# Altium schematic sheet 室内空气监测STM32.SchDoc
size A2
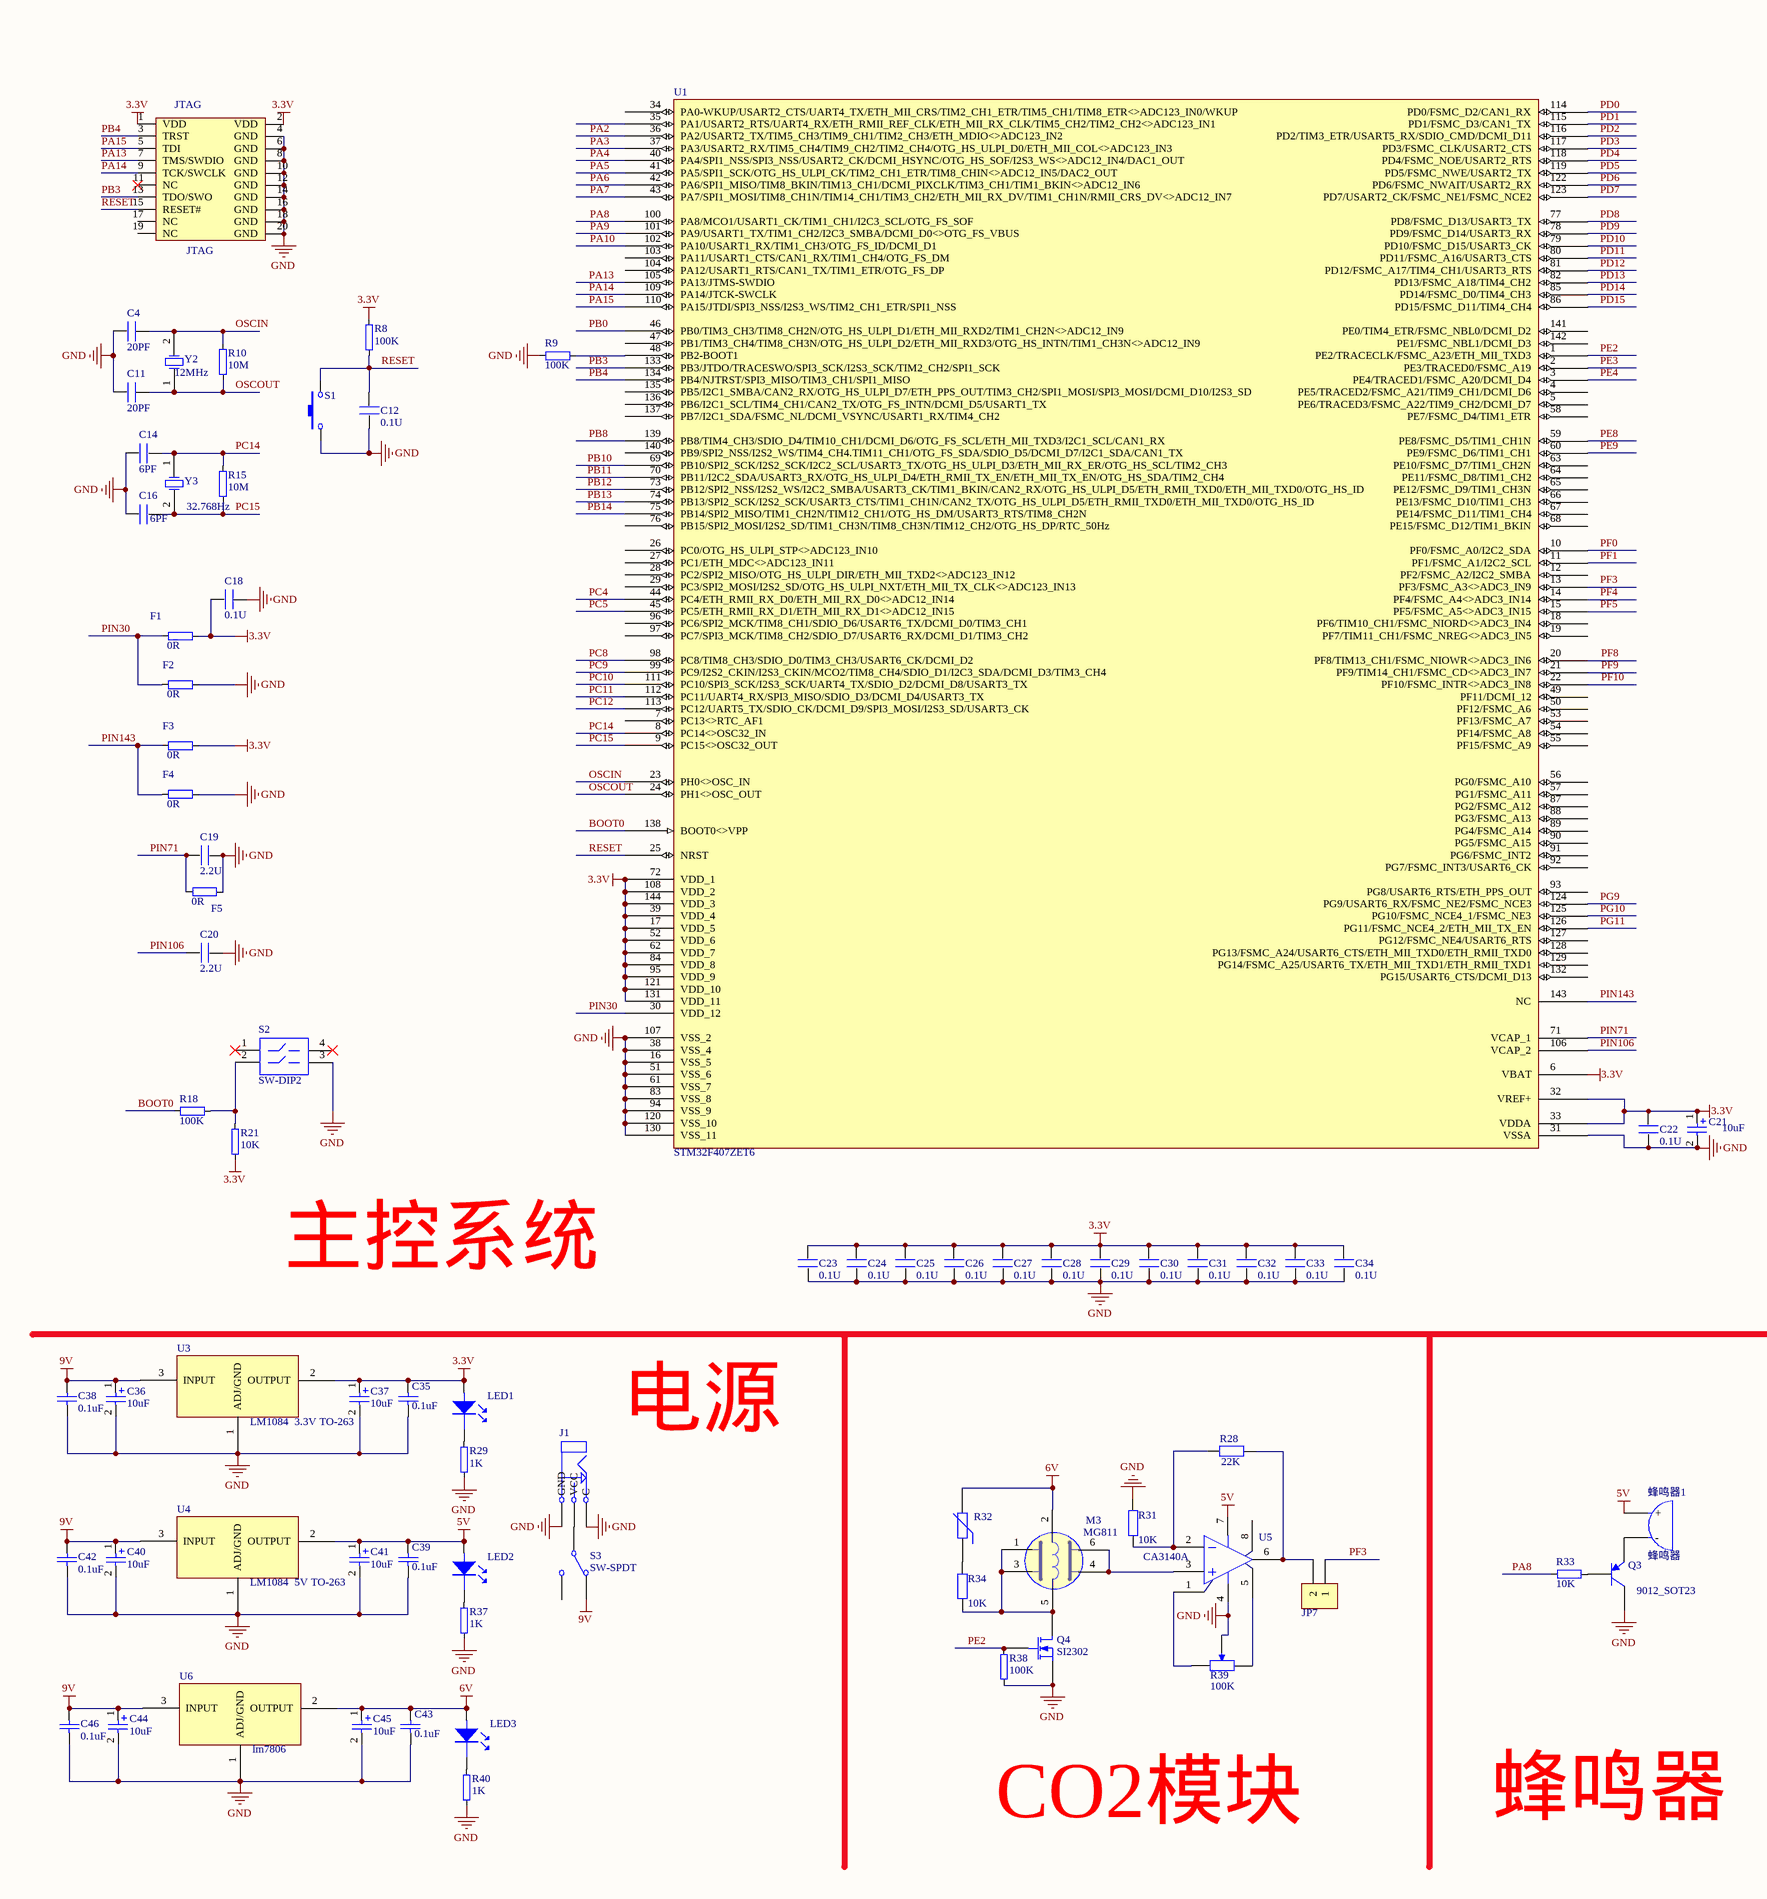
[diagram p0: 室内空气监测STM32.SchDoc, left]
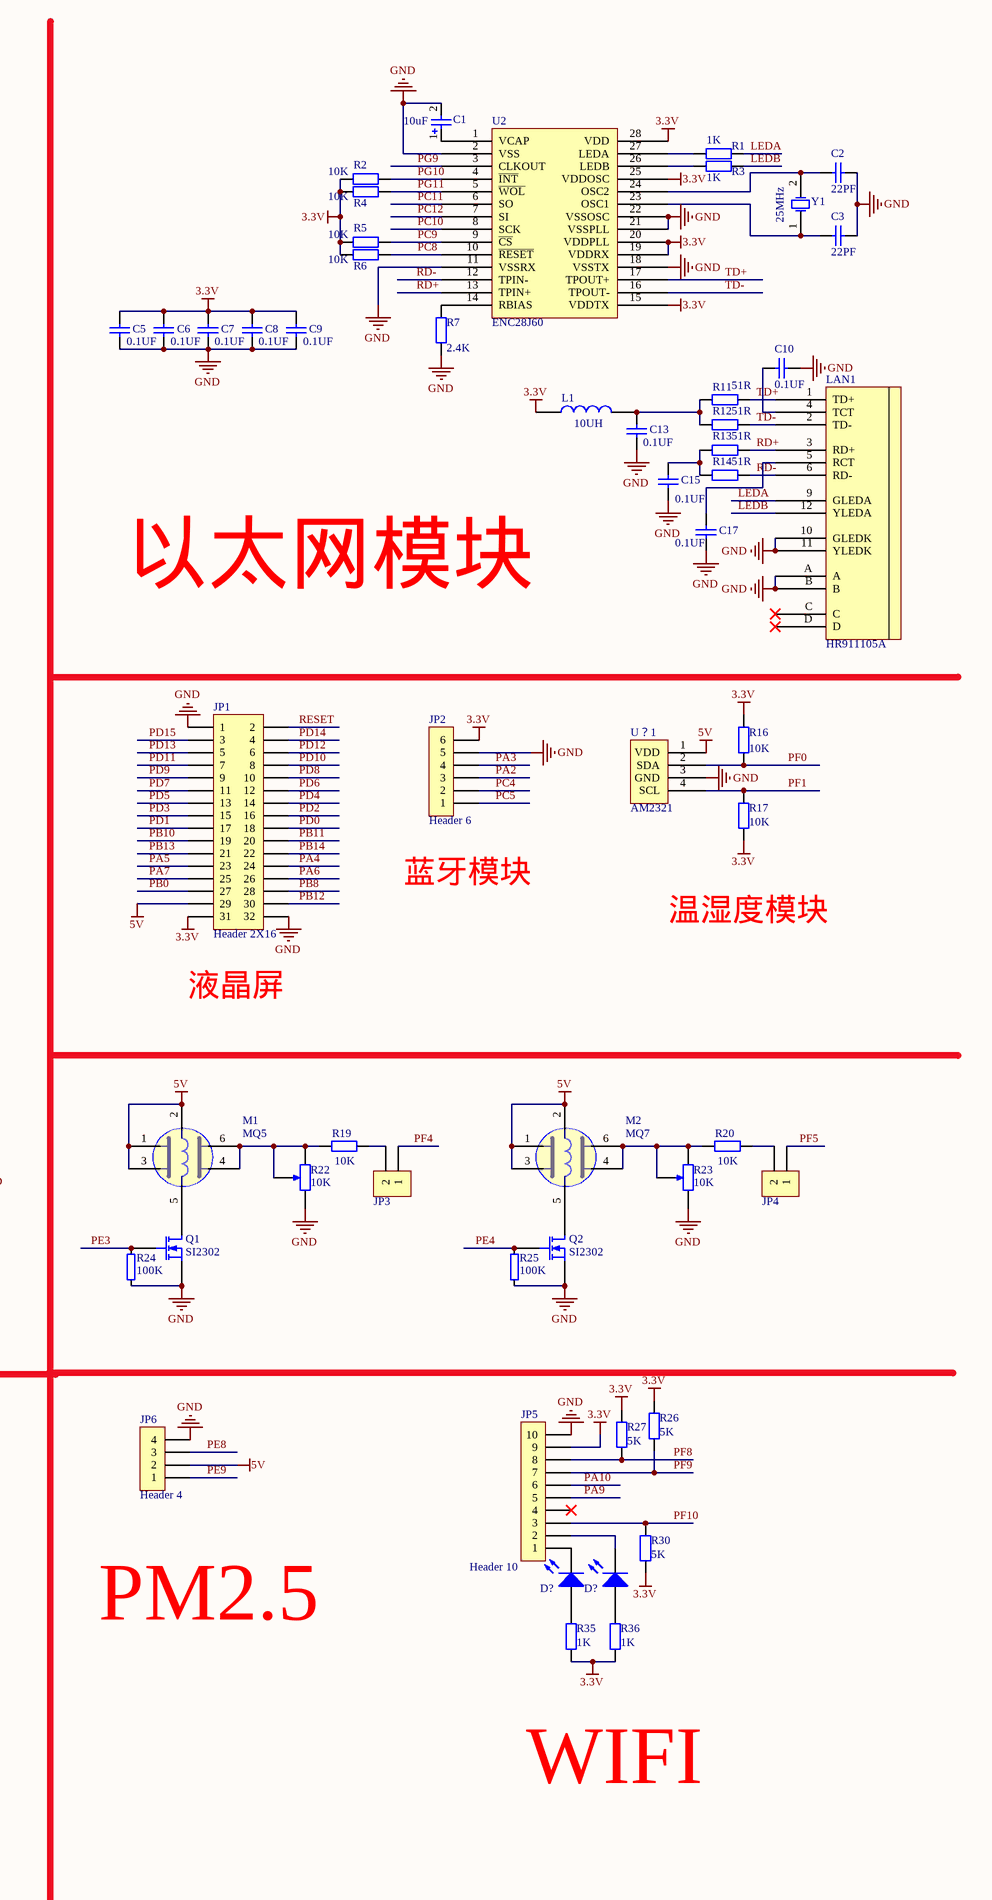
[diagram p1: 室内空气监测STM32.SchDoc, right]

## Parts
(Parts that share a designator on the sheet are numbered #1, #2 ... from top to bottom, then left to right.)
C1  value 10uF  [0805C 10uf]  (hidden comment: Cap Pol2)
C2  22PF  [0603C]
C3  22PF  [0603C]
C4  20PF  [0603P]
C5  0.1UF  [0603C]
C6  0.1UF  [0603C]
C7  0.1UF  [0603C]
C8  0.1UF  [0603C]
C9  0.1UF  [0603C]
C10  0.1UF  [0603C]
C11  20PF  [0603P]
C12  0.1U  [0603P]
C13  0.1UF  [0603C]
C14  6PF  [0603P]
C15  0.1UF  [0603C]
C16  6PF  [0603P]
C17  0.1UF  [0603C]
C18  0.1U  [0603P]
C19  2.2U  [0603P]
C20  2.2U  [0603P]
C21  value 10uF  [0805]
C22  0.1U  [0603P]
C23  0.1U  [0603P]
C24  0.1U  [0603P]
C25  0.1U  [0603P]
C26  0.1U  [0603P]
C27  0.1U  [0603P]
C28  0.1U  [0603P]
C29  0.1U  [0603P]
C30  0.1U  [0603P]
C31  0.1U  [0603P]
C32  0.1U  [0603P]
C33  0.1U  [0603P]
C34  0.1U  [0603P]
C35  0.1uF  [0603C]
C36  value 10uF  [0805C 10uf]  (hidden comment: Cap Pol2)
C37  value 10uF  [0805C 10uf]  (hidden comment: Cap Pol2)
C38  0.1uF  [0603C]
C39  0.1uF  [0603C]
C40  value 10uF  [0805C 10uf]  (hidden comment: Cap Pol2)
C41  value 10uF  [0805C 10uf]  (hidden comment: Cap Pol2)
C42  0.1uF  [0603C]
C43  0.1uF  [0603C]
C44  value 10uF  [0805C 10uf]  (hidden comment: Cap Pol2)
C45  value 10uF  [0805C 10uf]  (hidden comment: Cap Pol2)
C46  0.1uF  [0603C]
D?#1  (no value)  [SMDLED]
D?#2  (no value)  [SMDLED]
F1  0R  [0603R]
F2  0R  [0603R]
F3  0R  [0603R]
F4  0R  [0603R]
F5  0R  [0603R]
J1  (no value)  [PWJ-2/3]
JP1  Header 2X16  [HDR2-16]
JP2  Header 6  [HDR1-6]
JP3  (no value)  [HDR1-2]
JP4  (no value)  [HDR1-2]
JP5  Header 10  [HDR1-10]
JP6  Header 4  [HDR1-4]
JP7  (no value)  [HDR1-2]
JTAG  JTAG  [JTAG_20]
L1  10UH  [0603L]
LAN1  HR911105A  [HR911105A]
LED1  (no value)  [0805D]
LED2  (no value)  [0805D]
LED3  (no value)  [0805D]
M1  MQ5  [MG811]
M2  MQ7  [MG811]
M3  MG811  [MG811]
Q1  SI2302  [SOT23]
Q2  SI2302  [SOT23]
Q3  9012_SOT23  [SOT-23-3L]
Q4  SI2302  [SOT23]
R1  value 1K  [0603R]
R2  value 10K  [0603R]
R3  value 1K  [0603R]
R4  value 10K  [0603R]
R5  value 10K  [0603R]
R6  value 10K  [0603R]
R7  value 2.4K  [0603R]
R8  100K  [0603R]
R9  100K  [0603R]
R10  10M  [0603R]
R11  value 51R  [0603R]
R12  value 51R  [0603R]
R13  value 51R  [0603R]
R14  value 51R  [0603R]
R15  10M  [0603R]
R16  value 10K  [0603R]
R17  value 10K  [0603R]
R18  100K  [0603R]
R19  value 10K  [0603R]
R20  value 10K  [0603R]
R21  10K  [0603R]
R22  value 10K  [电位器 贴片]  (hidden comment: RES-Pot2)
R23  value 10K  [电位器 贴片]  (hidden comment: RES-Pot2)
R24  100K  [0603R]
R25  100K  [0603R]
R26  value 5K  [0603R]
R27  value 5K  [0603R]
R28  value 22K  [0603R]
R29  1K  [0603R]
R30  value 5K  [0603R]
R31  value 10K  [0603R]
R32  (no value)  [0603R]
R33  10K  [0603R]
R34  value 10K  [0603R]
R35  value 1K  [0603R]
R36  value 1K  [0603R]
R37  1K  [0603R]
R38  100K  [0603R]
R39  value 100K  [电位器 贴片]  (hidden comment: RES-Pot2)
R40  1K  [0603R]
S1  (no value)  [两脚贴片按键]
S2  SW-DIP2  [SW-DIP-2]
S3  SW-SPDT  [大电流拨动开关 两档三脚]
U1  STM32F407ZET6  [LQFP144]
U2  ENC28J60  [SSOP28]
U3  LM1084  3.3V TO-263  [LM1084 TO-263]
U4  LM1084  5V TO-263  [LM1084 TO-263]
U5  CA3140A  [SOP8]
U6  lm7806  [LM1084 TO-263]
U？1  AM2321  [AM2321]
Y1  25MHz  [XTAL_US]
Y2  12MHz  [XTAL_US]
Y3  value 32.768Hz  [BCY-W2/32.768KHz]
蜂鸣器1  蜂鸣器  [BELL0.3-0.46]

## Nets
3.3V: C5.1 C6.1 C7.1 C8.1 C9.1 C18.2 C21.1 C22.2 C23.2 C24.2 C25.2 C26.2 C27.2 C28.2 C29.2 C30.2 C31.2 C32.2 C33.2 C34.2 C35.2 C37.1 F1.2 F3.2 JP1.31 JP2.6 JP5.9 JTAG.1(VDD) JTAG.2(VDD) L1.1 LED1.A R2.1 R4.1 R5.1 R6.1 R8.2 R16.1 R17.2 R21.1 R26.1 R27.1 R30.2 R35.2 R36.2 U1.6(VBAT) U1.17(VDD_5) U1.32(VREF+) U1.33(VDDA) U1.39(VDD_4) U1.52(VDD_6) U1.62(VDD_7) U1.72(VDD_1) U1.84(VDD_8) U1.95(VDD_9) U1.108(VDD_2) U1.121(VDD_10) U1.131(VDD_11) U1.144(VDD_3) U2.15(VDDTX) U2.19(VDDRX) U2.20(VDDPLL) U2.25(VDDOSC) U2.28(VDD) U3.2(OUTPUT)
5V: C39.2 C41.1 JP1.29 JP6.2 LED2.A M1.1 M1.2 M1.3 M2.1 M2.2 M2.3 U4.2(OUTPUT) U5.7 U？1.1(VDD) 蜂鸣器1.1(+)
6V: C43.2 C45.1 LED3.A M3.2 R32.2 U6.2(OUTPUT)
9V: C36.1 C38.2 C40.1 C42.2 C44.1 C46.2 S3.1(NC) U3.3(INPUT) U4.3(INPUT) U6.3(INPUT)
GND: C1.2 C2.1 C3.1 C4.2 C5.2 C6.2 C7.2 C8.2 C9.2 C10.2 C11.2 C12.1 C13.2 C14.1 C15.1 C16.1 C17.2 C18.1 C19.1 C20.1 C21.2 C22.1 C23.1 C24.1 C25.1 C26.1 C27.1 C28.1 C29.1 C30.1 C31.1 C32.1 C33.1 C34.1 C35.1 C36.2 C37.2 C38.1 C39.1 C40.2 C41.2 C42.1 C43.1 C44.2 C45.2 C46.1 F2.2 F4.2 F5.2 J1.2(GND) J1.3(C) JP1.1 JP1.32 JP2.5 JP5.10 JP6.4 JTAG.4(GND) JTAG.6(GND) JTAG.8(GND) JTAG.10(GND) JTAG.12(GND) JTAG.14(GND) JTAG.16(GND) JTAG.18(GND) JTAG.20(GND) LAN1.10(GLEDK) LAN1.11(YLEDK) LAN1.A LAN1.B Q1.2(S) Q2.2(S) Q3.3(C) Q4.2(S) R7.1 R9.2 R22.1(BOT) R23.1(BOT) R24.2 R25.2 R29.2 R31.2 R37.2 R38.2 R39.2(TAP) R40.2 S1.1 S2.3 U1.16(VSS_5) U1.31(VSSA) U1.38(VSS_4) U1.51(VSS_6) U1.61(VSS_7) U1.83(VSS_8) U1.94(VSS_9) U1.107(VSS_2) U1.120(VSS_10) U1.130(VSS_11) U2.2(VSS) U2.11(VSSRX) U2.18(VSSTX) U2.21(VSSPLL) U2.22(VSSOSC) U3.1(ADJ/GND) U4.1(ADJ/GND) U5.4 U6.1(ADJ/GND) U？1.3(GND)
BOOT0: R18.1 U1.138(BOOT0<>VPP)
LEDA: LAN1.9(GLEDA) R1.2
LEDB: LAN1.12(YLEDA) R3.2
OSCIN: C4.1 R10.2 U1.23(PH0<>OSC_IN) Y2.2(OSC2)
OSCOUT: C11.1 R10.1 U1.24(PH1<>OSC_OUT) Y2.1(OSC1)
PA2: JP2.3 U1.36(PA2/USART2_TX/TIM5_CH3/TIM9_CH1/TIM2_CH3/ETH_MDIO<>ADC123_IN2)
PA3: JP2.4 U1.37(PA3/USART2_RX/TIM5_CH4/TIM9_CH2/TIM2_CH4/OTG_HS_ULPI_D0/ETH_MII_COL<>ADC123_IN3)
PA4: JP1.24 U1.40(PA4/SPI1_NSS/SPI3_NSS/USART2_CK/DCMI_HSYNC/OTG_HS_SOF/I2S3_WS<>ADC12_IN4/DAC1_OUT)
PA5: JP1.23 U1.41(PA5/SPI1_SCK/OTG_HS_ULPI_CK/TIM2_CH1_ETR/TIM8_CHIN<>ADC12_IN5/DAC2_OUT)
PA6: JP1.26 U1.42(PA6/SPI1_MISO/TIM8_BKIN/TIM13_CH1/DCMI_PIXCLK/TIM3_CH1/TIM1_BKIN<>ADC12_IN6)
PA7: JP1.25 U1.43(PA7/SPI1_MOSI/TIM8_CH1N/TIM14_CH1/TIM3_CH2/ETH_MII_RX_DV/TIM1_CH1N/RMII_CRS_DV<>ADC12_IN7)
PA8: R33.2 U1.100(PA8/MCO1/USART1_CK/TIM1_CH1/I2C3_SCL/OTG_FS_SOF)
PA9: JP5.5 U1.101(PA9/USART1_TX/TIM1_CH2/I2C3_SMBA/DCMI_D0<>OTG_FS_VBUS)
PA10: JP5.6 U1.102(PA10/USART1_RX/TIM1_CH3/OTG_FS_ID/DCMI_D1)
PA13: JTAG.7(TMS/SWDIO) U1.105(PA13/JTMS-SWDIO)
PA14: JTAG.9(TCK/SWCLK) U1.109(PA14/JTCK-SWCLK)
PA15: JTAG.5(TDI) U1.110(PA15/JTDI/SPI3_NSS/I2S3_WS/TIM2_CH1_ETR/SPI1_NSS)
PB0: JP1.27 U1.46(PB0/TIM3_CH3/TIM8_CH2N/OTG_HS_ULPI_D1/ETH_MII_RXD2/TIM1_CH2N<>ADC12_IN9)
PB3: JTAG.13(TDO/SWO) U1.133(PB3/JTDO/TRACESWO/SPI3_SCK/I2S3_SCK/TIM2_CH2/SPI1_SCK)
PB4: JTAG.3(TRST) U1.134(PB4/NJTRST/SPI3_MISO/TIM3_CH1/SPI1_MISO)
PB8: JP1.28 U1.139(PB8/TIM4_CH3/SDIO_D4/TIM10_CH1/DCMI_D6/OTG_FS_SCL/ETH_MII_TXD3/I2C1_SCL/CAN1_RX)
PB10: JP1.19 U1.69(PB10/SPI2_SCK/I2S2_SCK/I2C2_SCL/USART3_TX/OTG_HS_ULPI_D3/ETH_MII_RX_ER/OTG_HS_SCL/TIM2_CH3)
PB11: JP1.20 U1.70(PB11/I2C2_SDA/USART3_RX/OTG_HS_ULPI_D4/ETH_RMII_TX_EN/ETH_MII_TX_EN/OTG_HS_SDA/TIM2_CH4)
PB12: JP1.30 U1.73(PB12/SPI2_NSS/I2S2_WS/I2C2_SMBA/USART3_CK/TIM1_BKIN/CAN2_RX/OTG_HS_ULPI_D5/ETH_RMII_TXD0/ETH_MII_TXD0/OTG_HS_ID)
PB13: JP1.21 U1.74(PB13/SPI2_SCK/I2S2_SCK/USART3_CTS/TIM1_CH1N/CAN2_TX/OTG_HS_ULPI_D5/ETH_RMII_TXD0/ETH_MII_TXD0/OTG_HS_ID)
PB14: JP1.22 U1.75(PB14/SPI2_MISO/TIM1_CH2N/TIM12_CH1/OTG_HS_DM/USART3_RTS/TIM8_CH2N)
PC4: JP2.2 U1.44(PC4/ETH_RMII_RX_D0/ETH_MII_RX_D0<>ADC12_IN14)
PC5: JP2.1 U1.45(PC5/ETH_RMII_RX_D1/ETH_MII_RX_D1<>ADC12_IN15)
PC8: R6.2 U1.98(PC8/TIM8_CH3/SDIO_D0/TIM3_CH3/USART6_CK/DCMI_D2) U2.10(~{RESET})
PC9: R5.2 U1.99(PC9/I2S2_CKIN/I2S3_CKIN/MCO2/TIM8_CH4/SDIO_D1/I2C3_SDA/DCMI_D3/TIM3_CH4) U2.9(~{CS})
PC10: U1.111(PC10/SPI3_SCK/I2S3_SCK/UART4_TX/SDIO_D2/DCMI_D8/USART3_TX) U2.8(SCK)
PC11: U1.112(PC11/UART4_RX/SPI3_MISO/SDIO_D3/DCMI_D4/USART3_TX) U2.6(SO)
PC12: U1.113(PC12/UART5_TX/SDIO_CK/DCMI_D9/SPI3_MOSI/I2S3_SD/USART3_CK) U2.7(SI)
PC14: C14.2 R15.2 U1.8(PC14<>OSC32_IN) Y3.1(OSC1)
PC15: C16.2 R15.1 U1.9(PC15<>OSC32_OUT) Y3.2(OSC2)
PD0: JP1.18 U1.114(PD0/FSMC_D2/CAN1_RX)
PD1: JP1.17 U1.115(PD1/FSMC_D3/CAN1_TX)
PD2: JP1.16 U1.116(PD2/TIM3_ETR/USART5_RX/SDIO_CMD/DCMI_D11)
PD3: JP1.15 U1.117(PD3/FSMC_CLK/USART2_CTS)
PD4: JP1.14 U1.118(PD4/FSMC_NOE/USART2_RTS)
PD5: JP1.13 U1.119(PD5/FSMC_NWE/USART2_TX)
PD6: JP1.12 U1.122(PD6/FSMC_NWAIT/USART2_RX)
PD7: JP1.11 U1.123(PD7/USART2_CK/FSMC_NE1/FSMC_NCE2)
PD8: JP1.10 U1.77(PD8/FSMC_D13/USART3_TX)
PD9: JP1.9 U1.78(PD9/FSMC_D14/USART3_RX)
PD10: JP1.8 U1.79(PD10/FSMC_D15/USART3_CK)
PD11: JP1.7 U1.80(PD11/FSMC_A16/USART3_CTS)
PD12: JP1.6 U1.81(PD12/FSMC_A17/TIM4_CH1/USART3_RTS)
PD13: JP1.5 U1.82(PD13/FSMC_A18/TIM4_CH2)
PD14: JP1.4 U1.85(PD14/FSMC_D0/TIM4_CH3)
PD15: JP1.3 U1.86(PD15/FSMC_D11/TIM4_CH4)
PE2: Q4.1(G) R38.1 U1.1(PE2/TRACECLK/FSMC_A23/ETH_MII_TXD3)
PE3: Q1.1(G) R24.1 U1.2(PE3/TRACED0/FSMC_A19)
PE4: Q2.1(G) R25.1 U1.3(PE4/TRACED1/FSMC_A20/DCMI_D4)
PE8: JP6.3 U1.59(PE8/FSMC_D5/TIM1_CH1N)
PE9: JP6.1 U1.60(PE9/FSMC_D6/TIM1_CH1)
PF0: R16.2 U1.10(PF0/FSMC_A0/I2C2_SDA) U？1.2(SDA)
PF1: R17.1 U1.11(PF1/FSMC_A1/I2C2_SCL) U？1.4(SCL)
PF3: JP7.1 U1.13(PF3/FSMC_A3<>ADC3_IN9)
PF4: JP3.1 U1.14(PF4/FSMC_A4<>ADC3_IN14)
PF5: JP4.1 U1.15(PF5/FSMC_A5<>ADC3_IN15)
PF8: JP5.8 R27.2 U1.20(PF8/TIM13_CH1/FSMC_NIOWR<>ADC3_IN6)
PF9: JP5.7 R26.2 U1.21(PF9/TIM14_CH1/FSMC_CD<>ADC3_IN7)
PF10: JP5.3 R30.1 U1.22(PF10/FSMC_INTR<>ADC3_IN8)
PG9: U1.124(PG9/USART6_RX/FSMC_NE2/FSMC_NCE3) U2.3(CLKOUT)
PG10: R2.2 U1.125(PG10/FSMC_NCE4_1/FSMC_NE3) U2.4(~{INT})
PG11: R4.2 U1.126(PG11/FSMC_NCE4_2/ETH_MII_TX_EN) U2.5(~{WOL})
PIN30: F1.1 F2.1 U1.30(VDD_12)
PIN71: C19.2 F5.1 U1.71(VCAP_1)
PIN106: C20.2 U1.106(VCAP_2)
PIN143: F3.1 F4.1 U1.143(NC)
RD+: LAN1.3(RD+) R13.1 U2.13(TPIN+)
RD-: LAN1.6(RD-) R14.1 U2.12(TPIN-)
RESET: C12.2 JP1.2 JTAG.15(RESET#) R8.1 S1.2 U1.25(NRST)
TD+: LAN1.1(TD+) R11.1 U2.17(TPOUT+)
TD-: LAN1.2(TD-) R12.1 U2.16(TPOUT-)
NetC1_1: C1.1 U2.1(VCAP)
NetC2_2: C2.2 U2.24(OSC2) Y1.2(OSC2)
NetC3_2: C3.2 U2.23(OSC1) Y1.1(OSC1)
NetC10_1: C10.1 LAN1.4(TCT)
NetC13_1: C13.1 L1.2 R11.2 R12.2
NetC15_2: C15.2 R13.2 R14.2
NetC17_1: C17.1 LAN1.5(RCT)
NetD?#1_1: D?#1.1(A) R35.1
NetD?#1_2: D?#1.2(K) JP5.1
NetD?#2_1: D?#2.1(A) R36.1
NetD?#2_2: D?#2.2(K) JP5.2
NetJ1_1: J1.1(VCC) S3.2(COMMON)
NetJP3_2: JP3.2 R19.2
NetJP4_2: JP4.2 R20.2
NetJP7_2: JP7.2 R28.1 U5.6
NetLED1_K: LED1.K R29.1
NetLED2_K: LED2.K R37.1
NetLED3_K: LED3.K R40.1
NetM1_4: M1.4 M1.6 R19.1 R22.2(TAP) R22.3(TOP)
NetM1_5: M1.5 Q1.3(D)
NetM2_4: M2.4 M2.6 R20.1 R23.2(TAP) R23.3(TOP)
NetM2_5: M2.5 Q2.3(D)
NetM3_1: M3.1 M3.3 M3.5 Q4.3(D) R34.1
NetM3_4: M3.4 M3.6 U5.3
NetQ3_1: Q3.1(B) R33.1
NetQ3_2: Q3.2(E) 蜂鸣器1.2(-)
NetR1_1: R1.1 U2.27(LEDA)
NetR3_1: R3.1 U2.26(LEDB)
NetR7_2: R7.2 U2.14(RBIAS)
NetR9_1: R9.1 U1.48(PB2-BOOT1)
NetR18_2: R18.2 R21.2 S2.2
NetR28_2: R28.2 R31.1 U5.2
NetR32_1: R32.1 R34.2
NetR39_1: R39.1(BOT) U5.1
NetR39_3: R39.3(TOP) U5.5

Not connected (* = marked no-connect by the designer): JP5 4*; JTAG 11(NC)* 17(NC) 19(NC); LAN1 C* D*; S2 1* 4*; S3 3(NO); U1 4(PE5/TRACED2/FSMC_A21/TIM9_CH1/DCMI_D6) 5(PE6/TRACED3/FSMC_A22/TIM9_CH2/DCMI_D7) 7(PC13<>RTC_AF1) 12(PF2/FSMC_A2/I2C2_SMBA) 18(PF6/TIM10_CH1/FSMC_NIORD<>ADC3_IN4) 19(PF7/TIM11_CH1/FSMC_NREG<>ADC3_IN5) 26(PC0/OTG_HS_ULPI_STP<>ADC123_IN10) 27(PC1/ETH_MDC<>ADC123_IN11) 28(PC2/SPI2_MISO/OTG_HS_ULPI_DIR/ETH_MII_TXD2<>ADC123_IN12) 29(PC3/SPI2_MOSI/I2S2_SD/OTG_HS_ULPI_NXT/ETH_MII_TX_CLK<>ADC123_IN13) 34(PA0-WKUP/USART2_CTS/UART4_TX/ETH_MII_CRS/TIM2_CH1_ETR/TIM5_CH1/TIM8_ETR<>ADC123_IN0/WKUP) 35(PA1/USART2_RTS/UART4_RX/ETH_RMII_REF_CLK/ETH_MII_RX_CLK/TIM5_CH2/TIM2_CH2<>ADC123_IN1) 47(PB1/TIM3_CH4/TIM8_CH3N/OTG_HS_ULPI_D2/ETH_MII_RXD3/OTG_HS_INTN/TIM1_CH3N<>ADC12_IN9) 49(PF11/DCMI_12) 50(PF12/FSMC_A6) 53(PF13/FSMC_A7) 54(PF14/FSMC_A8) 55(PF15/FSMC_A9) 56(PG0/FSMC_A10) 57(PG1/FSMC_A11) 58(PE7/FSMC_D4/TIM1_ETR) 63(PE10/FSMC_D7/TIM1_CH2N) 64(PE11/FSMC_D8/TIM1_CH2) 65(PE12/FSMC_D9/TIM1_CH3N) 66(PE13/FSMC_D10/TIM1_CH3) 67(PE14/FSMC_D11/TIM1_CH4) 68(PE15/FSMC_D12/TIM1_BKIN) 76(PB15/SPI2_MOSI/I2S2_SD/TIM1_CH3N/TIM8_CH3N/TIM12_CH2/OTG_HS_DP/RTC_50Hz) 87(PG2/FSMC_A12) 88(PG3/FSMC_A13) 89(PG4/FSMC_A14) 90(PG5/FSMC_A15) 91(PG6/FSMC_INT2) 92(PG7/FSMC_INT3/USART6_CK) 93(PG8/USART6_RTS/ETH_PPS_OUT) 96(PC6/SPI2_MCK/TIM8_CH1/SDIO_D6/USART6_TX/DCMI_D0/TIM3_CH1) 97(PC7/SPI3_MCK/TIM8_CH2/SDIO_D7/USART6_RX/DCMI_D1/TIM3_CH2) 103(PA11/USART1_CTS/CAN1_RX/TIM1_CH4/OTG_FS_DM) 104(PA12/USART1_RTS/CAN1_TX/TIM1_ETR/OTG_FS_DP) 127(PG12/FSMC_NE4/USART6_RTS) 128(PG13/FSMC_A24/USART6_CTS/ETH_MII_TXD0/ETH_RMII_TXD0) 129(PG14/FSMC_A25/USART6_TX/ETH_MII_TXD1/ETH_RMII_TXD1) 132(PG15/USART6_CTS/DCMI_D13) 135(PB5/I2C1_SMBA/CAN2_RX/OTG_HS_ULPI_D7/ETH_PPS_OUT/TIM3_CH2/SPI1_MOSI/SPI3_MOSI/DCMI_D10/I2S3_SD) 136(PB6/I2C1_SCL/TIM4_CH1/CAN2_TX/OTG_FS_INTN/DCMI_D5/USART1_TX) 137(PB7/I2C1_SDA/FSMC_NL/DCMI_VSYNC/USART1_RX/TIM4_CH2) 140(PB9/SPI2_NSS/I2S2_WS/TIM4_CH4.TIM11_CH1/OTG_FS_SDA/SDIO_D5/DCMI_D7/I2C1_SDA/CAN1_TX) 141(PE0/TIM4_ETR/FSMC_NBL0/DCMI_D2) 142(PE1/FSMC_NBL1/DCMI_D3); U5 8

## Notes on the sheet
- 以太网模块
- 蓝牙模块
- 温湿度模块
- 液晶屏
- 主控系统
- 电源
- PM2.5
- WIFI
- CO2模块
- 蜂鸣器

## Library data of the parts
C1 C21 C36 C37 C40 C41 C44 C45 = Cap Pol2: Polarized Capacitor (Axial); Manufacturer: Generic Components; Class: Passive; Published: 08/06/2000; Publisher: Altium Hobart Technology Centre; SubClass: Capacitor
C2 C3 C5-C10 C13 C15 C17 C35 C38 C39 C42 C43 C46 = Cap: Capacitor; Manufacturer: Generic Components; Class: Passive; Published: 08/06/2000; Publisher: Altium Hobart Technology Centre; SubClass: Capacitor
C4 C11 C12 C14 C16 C18-C20 C22-C34 = C
D?#1 D?#2 = LED2: Typical RED, GREEN, YELLOW, AMBER GaAs LED; Published: 8-Jun-2000; LatestRevisionDate: 17-Jul-2002; LatestRevisionNote: Re-released for DXP Platform.; PackageDocument: Feb-2002; PackageReference: 3.2X1.6X1.1; Publisher: Altium Limited
F1-F5 R8-R10 R15 R18 R21 R24 R25 R29 R33 R37 R38 R40 = R-10K: resistor
J1 = Powerjack_F: 2-Conductor Jack with 1 break contact; Manufacturer: Generic Components; Class: Connector
JP1 = Header 2X16: Header, 16Pin, Dual row; Manufacturer: Generic Components; Class: Connector
JP2 = Header 6: Header, 6-Pin; Manufacturer: Generic Components; Class: Connector
JP3 JP4 JP7 = Header 2: Header, 2-Pin; Manufacturer: Generic Components; Class: Connector
JP5 = Header 10: Header, 10-Pin; Manufacturer: Generic Components; Class: Connector
JP6 = Header 4: Header, 4-Pin; Manufacturer: Generic Components; Class: Connector
L1 = INDUCTOR
LED1-LED3 = D-LED: LED
M1 M2 = MG811
Q1 Q2 Q4 = SI2302 A2SHB: N-Channel MOSFET; Manufacturer: Generic Components; Class: Discrete; SubClass: MOSFET - Low Power; Published: 08/06/2000; Publisher: Altium Hobart Technology Centre
R1-R7 R11-R14 R16 R17 R19 R20 R26-R28 R30 R31 R34-R36 = Res: Resistor; Manufacturer: Generic Components; Class: Passive; Published: 08/06/2000; Publisher: Altium Hobart Technology Centre; SubClass: Resistor
R22 R23 R39 = RES-Pot2: Potentiometer; Class: Passive; SubClass: Potentiometer
R32 = Res Varistor: Published: 24-Mar-1999; LatestRevisionDate: 4-Mar-2005; LatestRevisionNote: PCB Footprint replaced.; Publisher: Altium Limited
S1 = SW-PB_1: Switch; Manufacturer: Generic Components; Published: 1999
S2 = SW-DIP2: DIP Switch,2-bit; Manufacturer: Generic Components; Published: 1999
S3 = SW-SPDT: Single-Pole, Double-Throw Switch; Manufacturer: Generic Components; Published: 1999
U3 U4 U6 = LM1084 TO-263
Y1 Y2 = XTAL: Crystal Oscillator; Published: 8-Jun-2000; LatestRevisionDate: 17-Jul-2002; LatestRevisionNote: Re-released for DXP Platform.; Publisher: Altium Limited
Y3 = XTAL: Crystal Oscillator; Manufacturer: Generic Components; Published: 08/06/2000; Publisher: Altium Hobart Technology Centre; Class: Oscillator; SubClass: Crystal Oscillator
蜂鸣器1 = Buzzer: Manufacturer: Generic Components; Published: 1999